# Altium schematic sheet MICRO_ATtiny88-MU.SchDoc: MICRO ATtiny88-MU
size A4; SheetNumber: 3; SheetTotal: 3
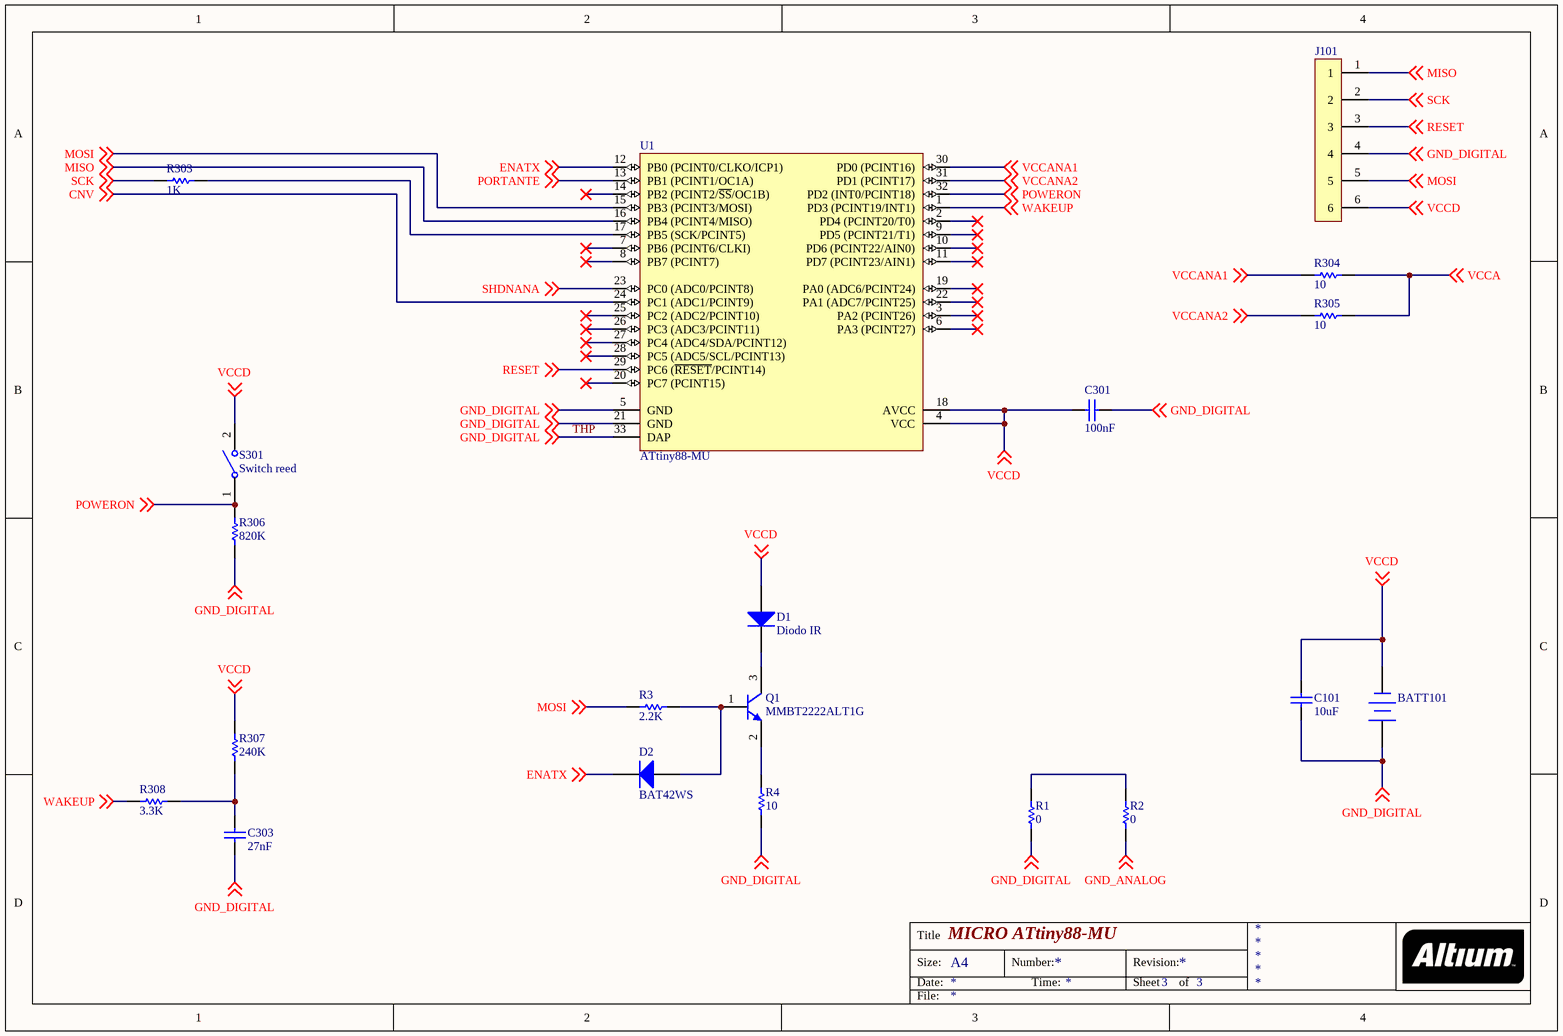
[diagram p0: MICRO_ATtiny88-MU.SchDoc]

## Parts
BATT101  BATTERIA  [BATT_3V]  (value not drawn)
C101  10uF  [0603 CAPACITOR]
C301  100nF  [0402 Capacitor]
C303  27nF  [0402 Capacitor]
D1  Diodo IR  [DIODE IR]
D2  BAT42WS  [SOD323-F]
J101  Header 2x3  [Header 2x3]  (value not drawn)
Q1  MMBT2222ALT1G  [SOT-523]
R1  0  [0402 resistor]
R2  0  [0402 resistor]
R3  2.2K  [0402 resistor]
R4  10  [0402 resistor]
R303  1K  [0402 resistor]
R304  10  [0402 resistor]
R305  10  [0402 resistor]
R306  820K  [0402 resistor]
R307  240K  [0402 resistor]
R308  3.3K  [0402 resistor]
S301  Switch reed  [REED_SWITCH_SMD]
U1  ATtiny88-MU  [ATtiny48-MU]

## Nets
CNV: U1.24(PC1_(ADC1/PCINT9)) ; off-sheet CNV
ENATX: D2.1(K) U1.12(PB0_(PCINT0/CLKO/ICP1)) ; off-sheet ENATX
GND_ANALOG: R2.1 ; off-sheet GND_ANALOG
MISO: J101.1 U1.16(PB4_(PCINT4/MISO)) ; off-sheet MISO
MOSI: J101.5 R3.1 U1.15(PB3_(PCINT3/MOSI)) ; off-sheet MOSI
PORTANTE: U1.13(PB1_(PCINT1/OC1A)) ; off-sheet PORTANTE
POWERON: R306.2 S301.1(NO) U1.32(PD2_(INT0/PCINT18)) ; off-sheet POWERON
RESET: J101.3 U1.29(PC6_(~{RESET}/PCINT14)) ; off-sheet RESET
SCK: J101.2 R303.1 ; off-sheet SCK
SHDNANA: U1.23(PC0_(ADC0/PCINT8)) ; off-sheet SHDNANA
THP: BATT101.1(+) C101.1 C301.2 C303.1 J101.4 R1.1 R4.1 R306.1 U1.5(GND) U1.21(GND) U1.33(DAP) ; off-sheet GND_DIGITAL  [also labelled GND_DIGITAL]
VCCA: R304.2 R305.2 ; off-sheet VCCA
VCCANA1: R304.1 U1.30(PD0_(PCINT16)) ; off-sheet VCCANA1
VCCANA2: R305.1 U1.31(PD1_(PCINT17)) ; off-sheet VCCANA2
VCCD: BATT101.2(-) C101.2 C301.1 D1.1(A) J101.6 R307.2 S301.2(NO) U1.4(VCC) U1.18(AVCC) ; off-sheet VCCD
WAKEUP: R308.1 U1.1(PD3_(PCINT19/INT1)) ; off-sheet WAKEUP
NetC303_2: C303.2 R307.1 R308.2
NetD1_2: D1.2(K) Q1.3(C)
NetD2_2: D2.2(A) Q1.1(B) R3.2
NetQ1_2: Q1.2(E) R4.2
NetR1_2: R1.2 R2.2
NetR303_2: R303.2 U1.17(PB5_(SCK/PCINT5))

Not connected (* = marked no-connect by the designer): U1 2(PD4_(PCINT20/T0))* 3(PA2_(PCINT26))* 6(PA3_(PCINT27))* 7(PB6_(PCINT6/CLKI))* 8(PB7_(PCINT7))* 9(PD5_(PCINT21/T1))* 10(PD6_(PCINT22/AIN0))* 11(PD7_(PCINT23/AIN1))* 14(PB2_(PCINT2/~{SS}/OC1B))* 19(PA0_(ADC6/PCINT24))* 20(PC7_(PCINT15))* 22(PA1_(ADC7/PCINT25))* 25(PC2_(ADC2/PCINT10))* 26(PC3_(ADC3/PCINT11))* 27(PC4_(ADC4/SDA/PCINT12))* 28(PC5_(ADC5/SCL/PCINT13))*

## Notes on the sheet
- Title
- Size:
- Date:
- A4
- Number:
- Time:
- Revision:
- Sheet
- of
- File:

## Library data of the parts
BATT101 = BATTERIA: Manufacturer: Panasonic - BSG; Manufacturer Part Number: CR-1616/F2N; Battery Chemistry: Lithium; Battery Cell Size: Coin, 16.0mm; Voltage - Rated: 3V; Capacity: 55mAh; Discharge Rate: 100µA; Shipping Info: Due to possible restrictions, a change in ship method may be required.; Supplier 1: Digi-Key; RoHS: RoHS Compliant By Exemption; Category: Battery Products; Stock 1: 3859; Pricing 1: 1=1.08, 10=0.964, 50=0.8576, 100=0.7503, 250=0.68604, 500=0.64314, 1200=0.58955, 3600=0.55365 (EUR); Size / Dimension: 0.63" Dia x 0.06" H (16.0mm x 1.6mm); Termination Style: SMD (SMT) Tab; Weight: -; ComponentLink1URL: http://na.industrial.panasonic.com/sites/default/pidsa/files/crseries_datasheets_merged.pdf; ComponentLink1Description: http://na.industrial.panasonic.com/sites/default/pidsa/files/crseries_datasheets_merged.pdf; Supplier Part Number 1: P273-ND
C101 C301 C303 = Cap SMD: Capacitor SMD 0402; Manufacturer: MULTICOMP; Manufacturer Part Number: MC0402X104M160CT; Code_IEC: 1005; Published: 8-Jun-2000; LatestRevisionDate: 29-May-2009; LatestRevisionNote: IPC-7351 Footprint Added.; PackageReference: 0402-A; Publisher: Altium Limited; PackageDescription: Chip Inductor; Code_JEITA: 0402; Supplier 1: Farnell; RoHS: YES; Stock 1: 436; Pricing 1: 1=0,003, 10=0,003, 100=0,003, 500=0,002, 1000=0,002 (EUR); ComponentLink1URL: http://www.newark.com/pdfs/datasheets/spc/Ta-1103.pdf; ComponentLink1Description: http://www.newark.com/pdfs/datasheets/spc/Ta-1103.pdf; Supplier Part Number 1: 1709894
  C101: Value: 10uF
  C301: Value: 100nF
  C303: Value: 27nF
D1 = Diode: Default Diode; Published: 8-Jun-2000; LatestRevisionDate: 17-Jul-2002; LatestRevisionNote: Re-released for DXP Platform.; PackageVersion: Sep-1996; PackageReference: SMC; Publisher: Altium Limited; PackageDescription: DO-214-AB/SMC; 2 C-Bend Leads; Body 7.9 x 5.9 mm, inc. leads (LxW); Code_JEDEC: DO-214-AB
D2 = BAT42WS: MULTICOMP - BAT42WS - DIODO, SCHOTTKY, 0.2A, 30V, SOD323-F; Supplier 1: Farnell; Manufacturer: MULTICOMP; RoHS: YES; Stock 1: 142897; Pricing 1: 5=0,0718, 150=0,052, 400=0,0414, 1250=0,0385, 3000=0,0355, 10000=0,0347, 25000=0,0339 (EUR); ComponentLink1URL: http://www.farnell.com/datasheets/1693093.pdf; ComponentLink1Description: http://www.farnell.com/datasheets/1693093.pdf; Supplier Part Number 1: 1621831; Manufacturer Part Number: BAT42WS
J101 = Header 2x3: header 2x3, pitch 2.54mm; Manufacturer: HARWIN; Manufacturer Part Number: M20-9980345; Code_IEC: 1005; Distanza di Passo: 2.54; No. di Righe: 2; No. di Contatti: 6; Tipo Terminazione Contatto: Foro Passante; Rivestimento Contatto: Oro; Materiale Contatto: Bronzo Fosforoso; Sostanze Estremamente Preoccupanti (SVHC): No SVHC (16-Jun-2014); Livello di Corrente: 3; Materiale Isolante: Poliestere; Metodo di Terminazione: a Saldare; No. di Cicli di Innesto: 300; Resistenza Contatto: 15; Resistenza di Isolamento: 10000; Temperatura di Esercizio Max: 105; Temperatura di Esercizio Min: -40; Tensione Nominale V AC: 750; Terminale Contatto: Foro Passante Verticale<!--FANDB--><div class="features-and-benefits-container"></div>; Published: 8-Jun-2000; LatestRevisionDate: 29-May-2009; LatestRevisionNote: IPC-7351 Footprint Added.; PackageReference: 0402-A; Publisher: Altium Limited; PackageDescription: Chip Inductor; Code_JEITA: 0402; Supplier 1: Farnell; RoHS: YES; Stock 1: 5365; Pricing 1: 10=0,33, 20=0,2, 50=0,175, 100=0,139, 250=0,118, 500=0,109, 500=0,0981, 4000=0,0724 (EUR); Serie: -; Genere: Header; Tensione di Funzionamento: 750; Tensione di Prova: 750; ComponentLink1URL: http://www.farnell.com/datasheets/1089577.pdf; ComponentLink1Description: http://www.farnell.com/datasheets/1089577.pdf; ComponentLink2URL: http://www.farnell.com/cad/112195.pdf; ComponentLink2Description: http://www.farnell.com/cad/112195.pdf; ComponentLink3URL: http://www.farnell.com/datasheets/1712126.pdf; ComponentLink3Description: http://www.farnell.com/datasheets/1712126.pdf; Supplier Part Number 1: 1022230
Q1 = MMBT2222ALT1G: General Purpose Transistor, NPN Silicon, 3-Pin SOT-23, Pb-Free, Tape and Reel; Manufacturer: On Semiconductor; fT Min (MHz): 300; IC Continuous (A): 0.6; DatasheetVersion: Rev. 10; PackageVersion: Rev. AP, 11/2009; PackageReference: SOT-23-3-318-08; PackageDescription: 3-Pin Small Outline Transistor, Body 2.92 x 1.3 mm, Pitch 0.95 mm; Supplier 1: Digi-Key; Supplier Part Number 1: MMBT2222ALT1GOSTR-ND; Supplier 2: Digi-Key; Supplier Part Number 2: MMBT2222ALT1GOSCT-ND; Supplier 3: Digi-Key; Supplier Part Number 3: MMBT2222ALT1GOSDKR-ND; Supplier 4: Farnell; Supplier Part Number 4: 1459098; Supplier 5: Farnell; Supplier Part Number 5: 1459098RL; Supplier 6: Newark; Supplier Part Number 6: 67H6854; Supplier 7: Newark; Supplier Part Number 7: 84K8795; Supplier 8: Mouser; Supplier Part Number 8: 863-MMBT2222ALT1G; Packing: Tape and Reel; Polarity: NPN; RoHS: TRUE; Mounting Technology: Surface Mount; PartNumber: MMBT2222ALT1G; ComponentLink1Description: Manufacturer URL; ComponentLink1URL: http://www.onsemi.com/; ComponentLink2Description: Datasheet; ComponentLink2URL: http://www.onsemi.cn/pub_link/Collateral/MMBT2222LT1-D.PDF; ComponentLink3Description: Package Specification; ComponentLink3URL: http://www.onsemi.cn/pub_link/Collateral/318-08.PDF
R1-R4 R303-R308 = RSMD: Resistor SMD 0402; Manufacturer: MULTICOMP; Manufacturer Part Number: MC00625W040212K; Gamma Prodotti: MULTICOMP - MC Series; Livello di Potenza: 62.5; Tolleranza Resistenza: ± 1%; Modello Case Resistore: 0402 [1005 Metric]; Materiale Elemento Resistivo: Film Spesso; Coefficiente di Temperatura: ± 100; Tensione Nominale: 50; Imballaggio: Nastro; Sostanze Estremamente Preoccupanti (SVHC): No SVHC (16-Jun-2014); Coefficiente di Temperatura +: 100; Intervallo Temperatura di Esercizio: da -55°C a +155; Larghezza Esterna: 1; Lunghezza/Altezza Esterna: 0.35; No. di Pin: 2; Profondità Esterna: 0.5; Serie: MC; Temperatura di Esercizio Max: 155; Temperatura di Esercizio Min: -55; Tolleranza +: 1%; Supplier 1: Farnell; RoHS: Y-EX; Stock 1: 19850; Pricing 1: 50=0,02, 250=0,019, 1000=0,016, 5000=0,012, 15000=0,011 (EUR); Livello di Sensibilità all'Umidità (MSL): -; Coefficiente di Temperatura -: 100; Montaggio Resistore: SMD; Tensione Nominale V DC: 50; Tolleranza -: 1; ComponentLink1URL: http://www.farnell.com/datasheets/1729045.pdf; ComponentLink1Description: http://www.farnell.com/datasheets/1729045.pdf; ComponentLink2URL: http://www.farnell.com/cad/1558901.zip; ComponentLink2Description: http://www.farnell.com/cad/1558901.zip; Supplier Part Number 1: 1358050
  R1 R2: Resistenza: 0
  R3: Resistenza: 2.2K
  R4 R304 R305: Resistenza: 10
  R303: Resistenza: 1K
  R306: Resistenza: 820K
  R307: Resistenza: 240K
  R308: Resistenza: 3.3K
S301 = SW_Switch: Code_IEC: 1005; Published: 8-Jun-2000; LatestRevisionDate: 29-May-2009; LatestRevisionNote: IPC-7351 Footprint Added.; PackageReference: 0402-A; Publisher: Altium Limited; PackageDescription: Chip Inductor; Code_JEITA: 0402
U1 = ATtiny88-MU: 8-bit AVR Microcontroller, 1.8-5.5V, 8KB Flash, 64 Bytes EEPROM, 512 Bytes SRAM, 32-pin MLF, Industrial Grade (-40°C to 85°C), Pb-Free; Published: 1-Apr-2010; DatasheetVersion: revC, Mar-2009; PackageVersion: revE, May-2006; PackageReference: 32M1-A; Publisher: Altium Limited; PackageDescription: 32-Pin Micro Lead Frame Package (MLF),  5 x 5 x 1.0 mm Body, Pitch 0.50 mm, 3.10mm Exposed Pad; Supplier 1: Digi-Key; Supplier Part Number 1: ATTINY88-MU-ND; Supplier 2: Farnell; Supplier Part Number 2: 1748549; Supplier 3: Mouser; Supplier Part Number 3: 556-ATTINY88-MU; Code_JEDEC: MO-220-VHHD-2; ComponentLink1Description: Manufacturer Link; ComponentLink1URL: http://www.atmel.com/products/avr/default.asp?; ComponentLink2Description: ATtiny48/88 Datasheet; ComponentLink2URL: http://www.atmel.com/dyn/resources/prod_documents/doc8008.pdf; ComponentLink3Description: ATtiny48/88 Summary; ComponentLink3URL: http://www.atmel.com/dyn/resources/prod_documents/8008S.pdf; ComponentLink4Description: Atmel.com Home; ComponentLink4URL: http://www.atmel.com